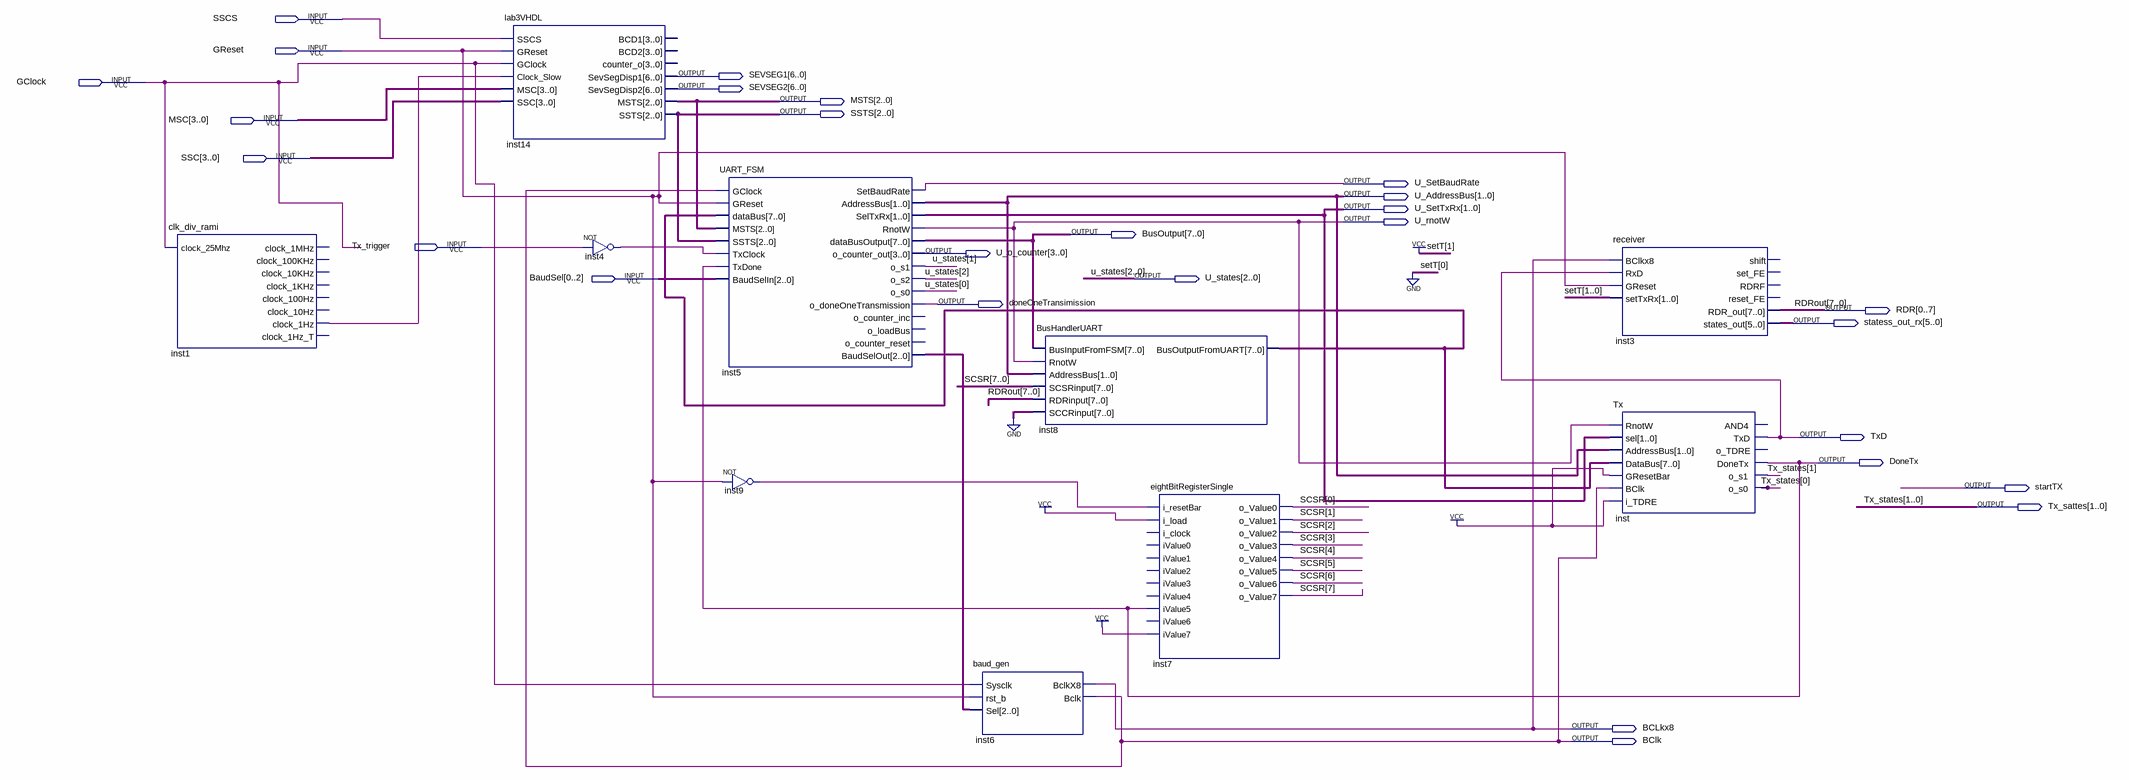
[diagram p0: schematic sheet]
// Quartus schematic projectDraft.bdf as structural Verilog: 10 symbols, 27 pins
module projectDraft (
  input  SSCS,
  input  GReset,
  input  GClock,
  input  [3:0] MSC,
  input  [3:0] SSC,
  input  Tx_trigger,
  input  [0:2] BaudSel,
  output [6:0] SEVSEG1,
  output [6:0] SEVSEG2,
  output [2:0] MSTS,
  output [2:0] SSTS,
  output U_SetBaudRate,
  output [1:0] U_AddressBus,
  output [1:0] U_SetTxRx,
  output U_rnotW,
  output [7:0] BusOutput,
  output [3:0] U_o_counter,
  output [2:0] U_states,
  output doneOneTransimission,
  output [0:7] RDR,
  output [5:0] statess_out_rx,
  output TxD,
  output DoneTx,
  output startTX,
  output [1:0] Tx_sattes,
  output BCLkx8,
  output BClk
);

  wire inst1_clock_1hz, inst4_out, inst9_out;
  wire [2:0] inst5_baudselout;
  wire [7:0] inst8_busoutputfromuart, SCSR;

  clk_div_rami inst1 (
    .clock_25Mhz(GClock), .clock_1Hz(inst1_clock_1hz));  // open: clock_1MHz, clock_100KHz, clock_10KHz, clock_1KHz, clock_100Hz, clock_10Hz, clock_1Hz_T
  lab3VHDL inst14 (
    .SSCS(SSCS), .GReset(GReset), .GClock(GClock), .Clock_Slow(inst1_clock_1hz), .MSC(MSC), .SSC(SSC),
    .SevSegDisp1(SEVSEG1), .SevSegDisp2(SEVSEG2), .MSTS(MSTS), .SSTS(SSTS));  // open: BCD1, BCD2, counter_o
  not inst4 (inst4_out, Tx_trigger);
  UART_FSM inst5 (
    .GClock(BClk), .GReset(GReset), .dataBus(inst8_busoutputfromuart), .MSTS(MSTS), .SSTS(SSTS),
    .TxClock(inst4_out), .TxDone(DoneTx), .BaudSelIn(BaudSel), .SetBaudRate(U_SetBaudRate),
    .AddressBus(U_AddressBus), .SelTxRx(U_SetTxRx), .RnotW(U_rnotW), .dataBusOutput(BusOutput),
    .o_counter_out(U_o_counter), .o_s1(U_states[1]), .o_s2(U_states[2]), .o_s0(U_states[0]),
    .o_doneOneTransmission(doneOneTransimission), .BaudSelOut(inst5_baudselout));  // open: o_counter_inc, o_loadBus, o_counter_reset
  not inst9 (inst9_out, GReset);
  baud_gen inst6 (.Sysclk(GClock), .rst_b(GReset), .Sel(inst5_baudselout), .BclkX8(BCLkx8), .Bclk(BClk));
  BusHandlerUART inst8 (
    .BusInputFromFSM(BusOutput), .RnotW(U_rnotW), .AddressBus(U_AddressBus), .SCSRinput(SCSR),
    .RDRinput(RDR), .SCCRinput({8{1'b0}}), .BusOutputFromUART(inst8_busoutputfromuart));
  eightBitRegisterSingle inst7 (
    .i_resetBar(inst9_out), .i_load(1'b1), .iValue5(DoneTx), .iValue7(1'b1), .o_Value0(SCSR[0]),
    .o_Value1(SCSR[1]), .o_Value2(SCSR[2]), .o_Value3(SCSR[3]), .o_Value4(SCSR[4]), .o_Value5(SCSR[5]),
    .o_Value6(SCSR[6]), .o_Value7(SCSR[7]));  // open: i_clock, iValue0, iValue1, iValue2, iValue3, iValue4, iValue6
  receiver inst3 (
    .BClkx8(BCLkx8), .RxD(TxD), .GReset(GReset), .setTxRx(2'b10), .RDR_out(RDR), .states_out(statess_out_rx));  // open: shift, set_FE, RDRF, reset_FE
  Tx inst (
    .RnotW(U_rnotW), .sel(U_SetTxRx), .AddressBus(U_AddressBus), .DataBus(inst8_busoutputfromuart),
    .GResetBar(1'b1), .BClk(BClk), .i_TDRE(1'b1), .TxD(TxD), .DoneTx(DoneTx), .o_s1(Tx_sattes[1]),
    .o_s0(Tx_sattes[0]));  // open: AND4, o_TDRE

  // Other names for the same wires on the sheet: RDRout[7:0] = RDR; Tx_states[1:0] = Tx_sattes
endmodule
